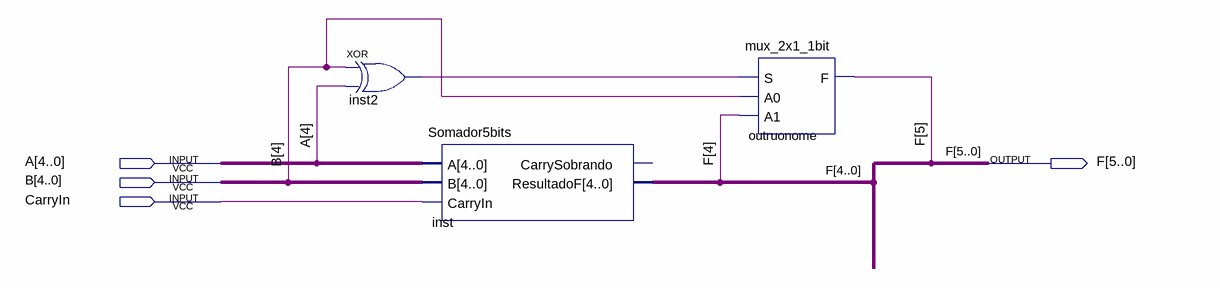
[diagram p0: schematic sheet]
// Quartus schematic SomadorPROMAX.bdf as structural Verilog: 3 symbols, 4 pins
module SomadorPROMAX (
  input  [4:0] A,
  input  [4:0] B,
  input  CarryIn,
  output [5:0] F
);

  wire inst2_out;

  xor inst2 (inst2_out, B[4], A[4]);
  Somador5bits inst (.A(A), .B(B), .CarryIn(CarryIn), .ResultadoF(F[4:0]));  // open: CarrySobrando
  mux_2x1_1bit outruonome (.S(inst2_out), .A0(B[4]), .A1(F[4]), .F(F[5]));
endmodule
